# Altium schematic sheet vme_can_fpga_pwr.SchDoc: =GlobalProjectName
size 209 x 297 mm; SheetNumber: 8; SheetTotal: 8; PageSetup: Record=PageOptions|CenterHorizontal=True|CenterVertical=True|PrintScale=1.00|XCorrection=1.00|YCorrection=1.00|PrintKind=1|BorderSize=5000000|LeftOffset=0|BottomOffset=0|Orientation=2|PaperLength=1000|PaperWidth=1000|Scale=100|PaperSource=15|PrintQuality=1200|MediaType=1|DitherType=10|PaperKind=A3|PrintScaleMode=1; Weight: -; ScaleFactor: -
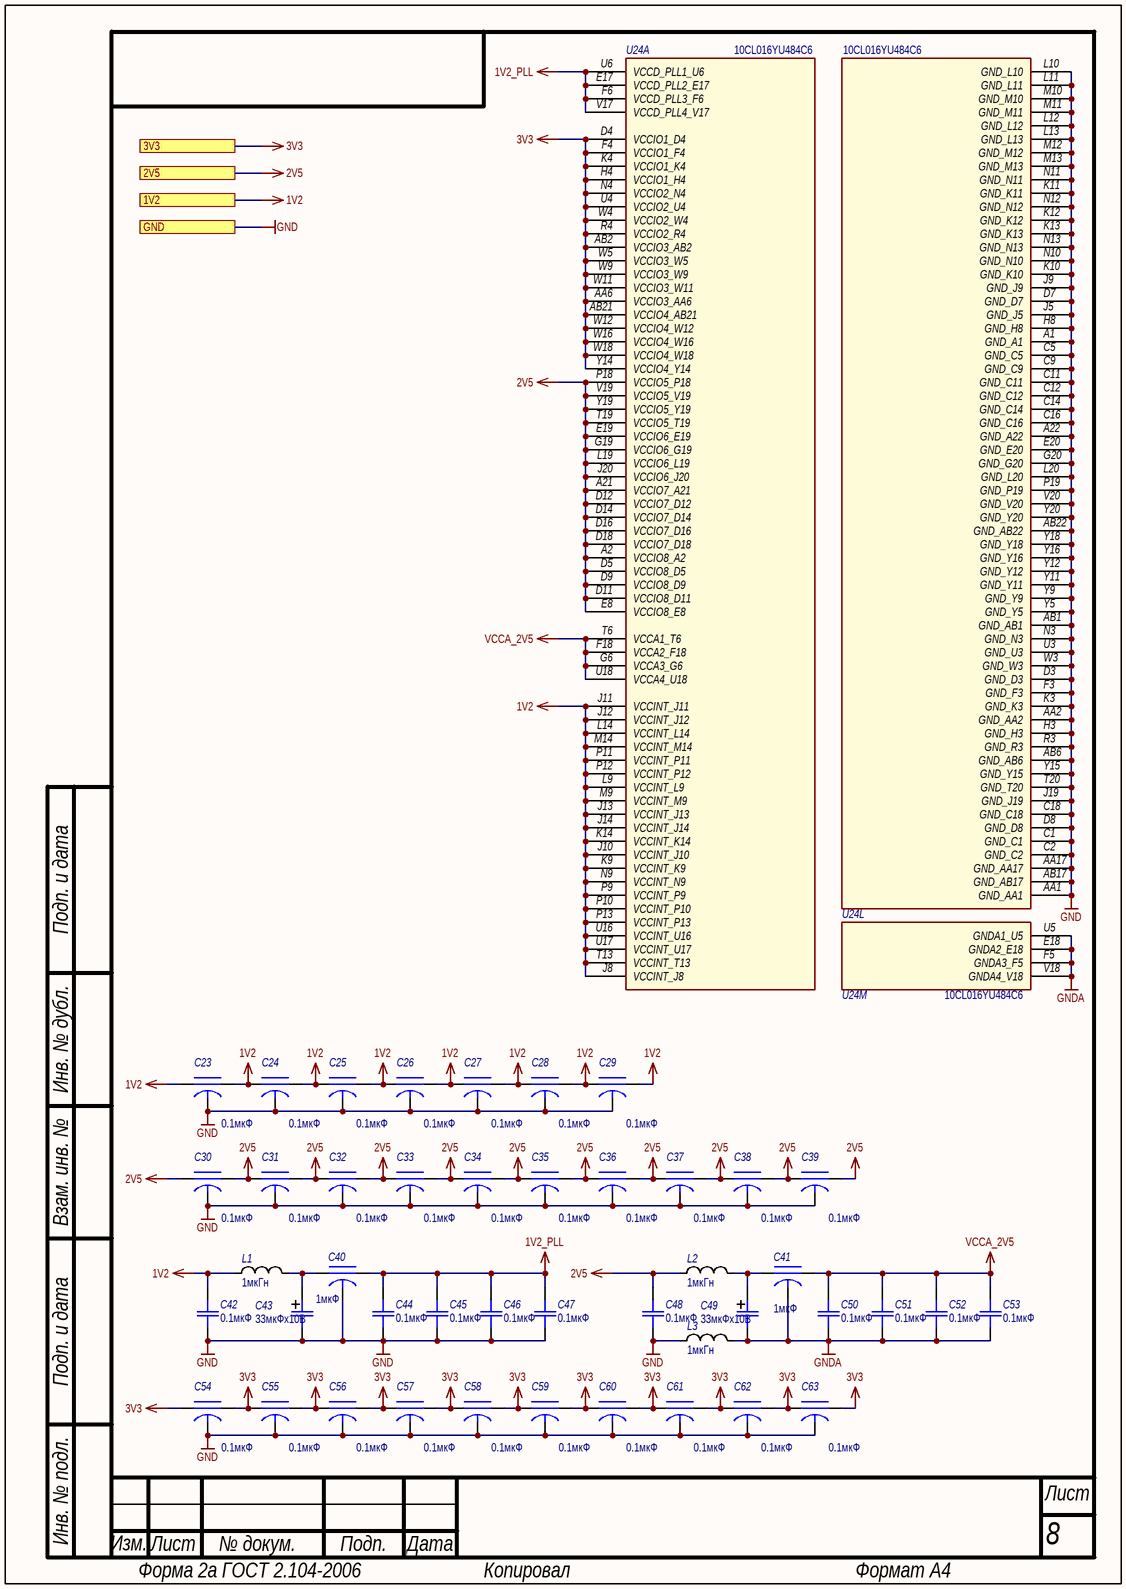
[diagram p0: vme_can_fpga_pwr.SchDoc]

## Parts
C23  value 0.1мкФ  [3pol_SMD0402]  (hidden comment: NFM15PC104D0J3)
C24  value 0.1мкФ  [3pol_SMD0402]  (hidden comment: NFM15PC104D0J3)
C25  value 0.1мкФ  [3pol_SMD0402]  (hidden comment: NFM15PC104D0J3)
C26  value 0.1мкФ  [3pol_SMD0402]  (hidden comment: NFM15PC104D0J3)
C27  value 0.1мкФ  [3pol_SMD0402]  (hidden comment: NFM15PC104D0J3)
C28  value 0.1мкФ  [3pol_SMD0402]  (hidden comment: NFM15PC104D0J3)
C29  value 0.1мкФ  [3pol_SMD0402]  (hidden comment: NFM15PC104D0J3)
C30  value 0.1мкФ  [3pol_SMD0402]  (hidden comment: NFM15PC104D0J3)
C31  value 0.1мкФ  [3pol_SMD0402]  (hidden comment: NFM15PC104D0J3)
C32  value 0.1мкФ  [3pol_SMD0402]  (hidden comment: NFM15PC104D0J3)
C33  value 0.1мкФ  [3pol_SMD0402]  (hidden comment: NFM15PC104D0J3)
C34  value 0.1мкФ  [3pol_SMD0402]  (hidden comment: NFM15PC104D0J3)
C35  value 0.1мкФ  [3pol_SMD0402]  (hidden comment: NFM15PC104D0J3)
C36  value 0.1мкФ  [3pol_SMD0402]  (hidden comment: NFM15PC104D0J3)
C37  value 0.1мкФ  [3pol_SMD0402]  (hidden comment: NFM15PC104D0J3)
C38  value 0.1мкФ  [3pol_SMD0402]  (hidden comment: NFM15PC104D0J3)
C39  value 0.1мкФ  [3pol_SMD0402]  (hidden comment: NFM15PC104D0J3)
C40  value 1мкФ  [3pol_SMD0402]  (hidden comment: NFM15PC105D0J3)
C41  value 1мкФ  [3pol_SMD0402]  (hidden comment: NFM15PC105D0J3)
C42  0.1мкФ  [SMD_C0402]
C43  33мкФх10В  [SMD_size_B]
C44  0.1мкФ  [SMD_C0402]
C45  0.1мкФ  [SMD_C0402]
C46  0.1мкФ  [SMD_C0402]
C47  0.1мкФ  [SMD_C0402]
C48  0.1мкФ  [SMD_C0402]
C49  33мкФх10В  [SMD_size_B]
C50  0.1мкФ  [SMD_C0402]
C51  0.1мкФ  [SMD_C0402]
C52  0.1мкФ  [SMD_C0402]
C53  0.1мкФ  [SMD_C0402]
C54  value 0.1мкФ  [3pol_SMD0402]  (hidden comment: NFM15PC104D0J3)
C55  value 0.1мкФ  [3pol_SMD0402]  (hidden comment: NFM15PC104D0J3)
C56  value 0.1мкФ  [3pol_SMD0402]  (hidden comment: NFM15PC104D0J3)
C57  value 0.1мкФ  [3pol_SMD0402]  (hidden comment: NFM15PC104D0J3)
C58  value 0.1мкФ  [3pol_SMD0402]  (hidden comment: NFM15PC104D0J3)
C59  value 0.1мкФ  [3pol_SMD0402]  (hidden comment: NFM15PC104D0J3)
C60  value 0.1мкФ  [3pol_SMD0402]  (hidden comment: NFM15PC104D0J3)
C61  value 0.1мкФ  [3pol_SMD0402]  (hidden comment: NFM15PC104D0J3)
C62  value 0.1мкФ  [3pol_SMD0402]  (hidden comment: NFM15PC104D0J3)
C63  value 0.1мкФ  [3pol_SMD0402]  (hidden comment: NFM15PC104D0J3)
L1  1мкГн  [SMD_0805]
L2  1мкГн  [SMD_0805]
L3  1мкГн  [SMD_0805]
U24  Наименование: 10CL016YU484С6  [UBGA-484]  (hidden comment: 10CL016YU484)  (parts A,L,M of 13)

## Ports
1V2, 2V5, 3V3, GND

## Nets
1V2: C23.1(Input) C23.3(Output) C24.1(Input) C24.3(Output) C25.1(Input) C25.3(Output) C26.1(Input) C26.3(Output) C27.1(Input) C27.3(Output) C28.1(Input) C28.3(Output) C29.1(Input) C29.3(Output) C42.2 L1.2 U24.J8(VCCINT_J8) U24.J10(VCCINT_J10) U24.J11(VCCINT_J11) U24.J12(VCCINT_J12) U24.J13(VCCINT_J13) U24.J14(VCCINT_J14) U24.K9(VCCINT_K9) U24.K14(VCCINT_K14) U24.L9(VCCINT_L9) U24.L14(VCCINT_L14) U24.M9(VCCINT_M9) U24.M14(VCCINT_M14) U24.N9(VCCINT_N9) U24.P9(VCCINT_P9) U24.P10(VCCINT_P10) U24.P11(VCCINT_P11) U24.P12(VCCINT_P12) U24.P13(VCCINT_P13) U24.T13(VCCINT_T13) U24.U16(VCCINT_U16) U24.U17(VCCINT_U17) ; port 1V2
1V2_PLL: C40.1(Input) C44.2 C45.2 C46.2 C47.2 U24.E17(VCCD_PLL2_E17) U24.F6(VCCD_PLL3_F6) U24.U6(VCCD_PLL1_U6) U24.V17(VCCD_PLL4_V17)
2V5: C30.1(Input) C30.3(Output) C31.1(Input) C31.3(Output) C32.1(Input) C32.3(Output) C33.1(Input) C33.3(Output) C34.1(Input) C34.3(Output) C35.1(Input) C35.3(Output) C36.1(Input) C36.3(Output) C37.1(Input) C37.3(Output) C38.1(Input) C38.3(Output) C39.1(Input) C39.3(Output) C48.2 L2.2 U24.A2(VCCIO8_A2) U24.A21(VCCIO7_A21) U24.D5(VCCIO8_D5) U24.D9(VCCIO8_D9) U24.D11(VCCIO8_D11) U24.D12(VCCIO7_D12) U24.D14(VCCIO7_D14) U24.D16(VCCIO7_D16) U24.D18(VCCIO7_D18) U24.E8(VCCIO8_E8) U24.E19(VCCIO6_E19) U24.G19(VCCIO6_G19) U24.J20(VCCIO6_J20) U24.L19(VCCIO6_L19) U24.P18(VCCIO5_P18) U24.T19(VCCIO5_T19) U24.V19(VCCIO5_V19) U24.Y19(VCCIO5_Y19) ; port 2V5
3V3: C54.1(Input) C54.3(Output) C55.1(Input) C55.3(Output) C56.1(Input) C56.3(Output) C57.1(Input) C57.3(Output) C58.1(Input) C58.3(Output) C59.1(Input) C59.3(Output) C60.1(Input) C60.3(Output) C61.1(Input) C61.3(Output) C62.1(Input) C62.3(Output) C63.1(Input) C63.3(Output) U24.AA6(VCCIO3_AA6) U24.AB2(VCCIO3_AB2) U24.AB21(VCCIO4_AB21) U24.D4(VCCIO1_D4) U24.F4(VCCIO1_F4) U24.H4(VCCIO1_H4) U24.K4(VCCIO1_K4) U24.N4(VCCIO2_N4) U24.R4(VCCIO2_R4) U24.U4(VCCIO2_U4) U24.W4(VCCIO2_W4) U24.W5(VCCIO3_W5) U24.W9(VCCIO3_W9) U24.W11(VCCIO3_W11) U24.W12(VCCIO4_W12) U24.W16(VCCIO4_W16) U24.W18(VCCIO4_W18) U24.Y14(VCCIO4_Y14) ; port 3V3
GND: C23.2(GND) C24.2(GND) C25.2(GND) C26.2(GND) C27.2(GND) C28.2(GND) C29.2(GND) C30.2(GND) C31.2(GND) C32.2(GND) C33.2(GND) C34.2(GND) C35.2(GND) C36.2(GND) C37.2(GND) C38.2(GND) C39.2(GND) C40.2(GND) C42.1 C43.2 C44.1 C45.1 C46.1 C47.1 C48.1 C54.2(GND) C55.2(GND) C56.2(GND) C57.2(GND) C58.2(GND) C59.2(GND) C60.2(GND) C61.2(GND) C62.2(GND) C63.2(GND) L3.2 U24.A1(GND_A1) U24.A22(GND_A22) U24.AA1(GND_AA1) U24.AA2(GND_AA2) U24.AA17(GND_AA17) U24.AB1(GND_AB1) U24.AB6(GND_AB6) U24.AB17(GND_AB17) U24.AB22(GND_AB22) U24.C1(GND_C1) U24.C2(GND_C2) U24.C5(GND_C5) U24.C9(GND_C9) U24.C11(GND_C11) U24.C12(GND_C12) U24.C14(GND_C14) U24.C16(GND_C16) U24.C18(GND_C18) U24.D3(GND_D3) U24.D7(GND_D7) U24.D8(GND_D8) U24.E20(GND_E20) U24.F3(GND_F3) U24.G20(GND_G20) U24.H3(GND_H3) U24.H8(GND_H8) U24.J5(GND_J5) U24.J9(GND_J9) U24.J19(GND_J19) U24.K3(GND_K3) U24.K10(GND_K10) U24.K11(GND_K11) U24.K12(GND_K12) U24.K13(GND_K13) U24.L10(GND_L10) U24.L11(GND_L11) U24.L12(GND_L12) U24.L13(GND_L13) U24.L20(GND_L20) U24.M10(GND_M10) U24.M11(GND_M11) U24.M12(GND_M12) U24.M13(GND_M13) U24.N3(GND_N3) U24.N10(GND_N10) U24.N11(GND_N11) U24.N12(GND_N12) U24.N13(GND_N13) U24.P19(GND_P19) U24.R3(GND_R3) U24.T20(GND_T20) U24.U3(GND_U3) U24.V20(GND_V20) U24.W3(GND_W3) U24.Y5(GND_Y5) U24.Y9(GND_Y9) U24.Y11(GND_Y11) U24.Y12(GND_Y12) U24.Y15(GND_Y15) U24.Y16(GND_Y16) U24.Y18(GND_Y18) U24.Y20(GND_Y20) ; port GND
GNDA: C41.2(GND) C49.2 C50.1 C51.1 C52.1 C53.1 L3.1 U24.E18(GNDA2_E18) U24.F5(GNDA3_F5) U24.U5(GNDA1_U5) U24.V18(GNDA4_V18)
VCCA_2V5: C41.1(Input) C50.2 C51.2 C52.2 C53.2 U24.F18(VCCA2_F18) U24.G6(VCCA3_G6) U24.T6(VCCA1_T6) U24.U18(VCCA4_U18)
NetC40_3: C40.3(Output) C43.1 L1.1
NetC41_3: C41.3(Output) C49.1 L2.1

## Notes on the sheet
- Подп. и дата
- Инв. № дубл.
- Взам. инв. №
- Инв. № подл.
- Изм.
- Лист
- № докум.
- Подп.
- Дата
- Форма 2а ГОСТ 2.104-2006
- Копировал
- Формат А4

## Library data of the parts
C23-C41 C54-C63 = Capacitop_3Pol: Large Current 3 Terminals Low ESL Chip Multilayer Ceramic Capacitors for General Purpose, 0402, 2200pF, 20%, 10V; Потребление, Вт: 0.0; Назначение: 3 Terminals Low ESL Chip Multilayer Ceramic Capacitors (EMIFIL) for General Purpose; ComponentLink1Description: DataSheet; ComponentLink1URL: https://search.murata.co.jp/Ceramy/image/img/A01X/G101/ENG/NFM15CC222D1A3-01.pdf; ComponentLink2Description: UsingMethod; ComponentLink2URL: https://article.murata.com/en-global/article/methods-of-using-low-esl-capacitors
  C23-C39 C54-C63: Наименование: NFM15PC104D0J3
  C40 C41: Наименование: NFM15PC105D0J3
C42 C44-C48 C50-C53 = Capacitor: Назначение: SMD-конденсатор; Наименование: Конденсатор; Потребление, Вт: 0; Value: 0.1мкФ
C43 C49 = Capacitor_pol: Polarized capacitor; Назначение: Поляризованный SMD-конденсатор; Наименование: Поляризованный конденсатор; Потребление, Вт: 0; Value: 33мкФх10В
L1-L3 = Inductor: Наименование: Индуктивность; Назначение: SMD-индуктивность; Потребление, Вт: 0,010; Value: 1мкГн
U24 = 10CL016_U484: Intel® Cyclone® 10 LP FPGA; Потребление, Вт: 0.5; Назначение: Intel® Cyclone® 10 LP FPGA; ComponentLink1Description: DataSheet; ComponentLink1URL: https://www.intel.com/content/dam/www/programmable/us/en/pdfs/literature/hb/cyclone-10/c10lp-51002.pdf; ComponentLink2Description: PinConnectionGuidlines; ComponentLink2URL: https://www.intel.com/content/dam/www/programmable/us/en/pdfs/literature/dp/cyclone-10/pcg-01021.pdf; Supplier 1: Mouser; Supplier Part Number 1: 989-10CL016YU484C6G